# Altium schematic sheet Motor_control_transistor.SchDoc
size A; SheetNumber: 2; SheetTotal: 4
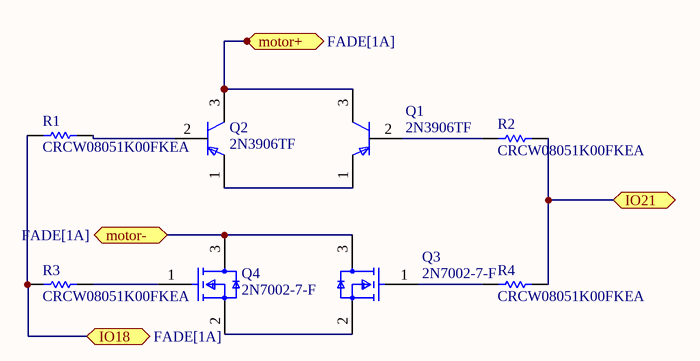
[diagram p0: Motor_control_transistor.SchDoc]

## Parts
Q1  2N3906TF  [FP-135AR-MFG]
Q2  2N3906TF  [FP-135AR-MFG]
Q3  2N7002-7-F  [FP-SOT23-MFG]
Q4  2N7002-7-F  [FP-SOT23-MFG]
R1  CRCW08051K00FKEA  [RESC2013X50X30NL20T20]
R2  CRCW08051K00FKEA  [RESC2013X50X30NL20T20]
R3  CRCW08051K00FKEA  [RESC2013X50X30NL20T20]
R4  CRCW08051K00FKEA  [RESC2013X50X30NL20T20]

## Ports
IO18 (bidir, see FADE[1A]), IO21 (bidir), motor+ (bidir, see FADE[1A]), motor- (bidir, see FADE[1A])

## Nets
IO18: R1.1 R3.1 ; port IO18
IO21: R2.2 R4.2 ; port IO21
motor+: Q1.3(C) Q2.3(C) ; port motor+
motor-: Q3.3(D) Q4.3(D) ; port motor-
NetQ1_1: Q1.1(E) Q2.1(E)
NetQ1_2: Q1.2(B) R2.1
NetQ2_2: Q2.2(B) R1.2
NetQ3_1: Q3.1(G) R4.1
NetQ3_2: Q3.2(S) Q4.2(S)
NetQ4_1: Q4.1(G) R3.2

## Library data of the parts
Q1 Q2 = CMP-00278-84408866-1: 2N3906TF Small Signal Bipolar Transistor, 0.2A I(C), 40V V(BR)CEO, 1-Element, PNP, Silicon, TO-92; Manufacturer Lifecycle Status: ACTIVE; Collector Base Voltage (VCBO): -40V; Frequency: 250MHz; Number of Elements: 1; Max Power Dissipation: 625mW; Max Breakdown Voltage: 160V; Current Rating: -200mA; Emitter Base Voltage (VEBO): -5V; Collector Emitter Saturation Voltage: -400mV; Element Configuration: Single; Max Junction Temperature (Tj): 150°C; hFE Min: 100; Polarity: PNP; Lead Free: Lead Free; RoHS: Compliant; Max Operating Temperature: 150°C; Collector Emitter Voltage (VCEO): -40V; Max Frequency: 250MHz; Power Dissipation: 625mW; Height: 5.33mm; Schedule B: 8541210080; Mount: Through Hole; Length: 5.2mm; REACH SVHC: No SVHC; Min Operating Temperature: -55°C; Gain Bandwidth Product: 250MHz; Number of Pins: 3; Lifecycle Status: Production; Transition Frequency: 250MHz; NexarPartId: 84408866; Collector Emitter Breakdown Voltage: -40V; Case/Package: TO-92; Packaging: Tape and Reel; Width: 4.19mm; Max Collector Current: -200mA; Radiation Hardening: No; Weight: 240mg; Voltage Rating (DC): -40V
Q3 Q4 = CMP-2000-04929-2: MOSFET N-CH 60V 115MA SOT23-3; Turn-On Delay Time: 7ns; Turn-Off Delay Time: 11ns; Drain to Source Resistance: 7.5R; Rise Time: 3ns; Drain to Source Breakdown Voltage: 70V; Input Capacitance: 50pF; Number of Elements: 1; Power Dissipation: 540mW; Max Power Dissipation: 300mW; Fall Time: 5.6ns; Gate to Source Voltage (Vgs): 20V; Threshold Voltage: 2.5V; Element Configuration: Single; Termination: SMD/SMT; Weight: 0.000282oz; Radiation Hardening: No; Max Operating Temperature: 150°C; On-State Resistance: 7.5R; Mount: Surface Mount; Current Rating: 115mA; Contact Plating: Tin; Lead Free: Lead Free; Min Operating Temperature: -55°C; Number of Pins: 3; REACH SVHC: No SVHC; Drain to Source Voltage (Vdss): 60V; Width: 1.3mm; Package Quantity: 3000; Length: 2.9mm; Case/Package: SOT-23; Number of Channels: 1; Dual Supply Voltage: 60V; Packaging: Tape and Reel; Height: 1mm; Voltage Rating (DC): 60V; Nominal Vgs: 2.5V; Continuous Drain Current (ID): 115mA; Voltage: 60V; Rds On Max: 7.5R
R1-R4 = CMP-1013-00510-2: Manufacturer: Vishay Dale; Part Number: CRCW08051K00FKEA